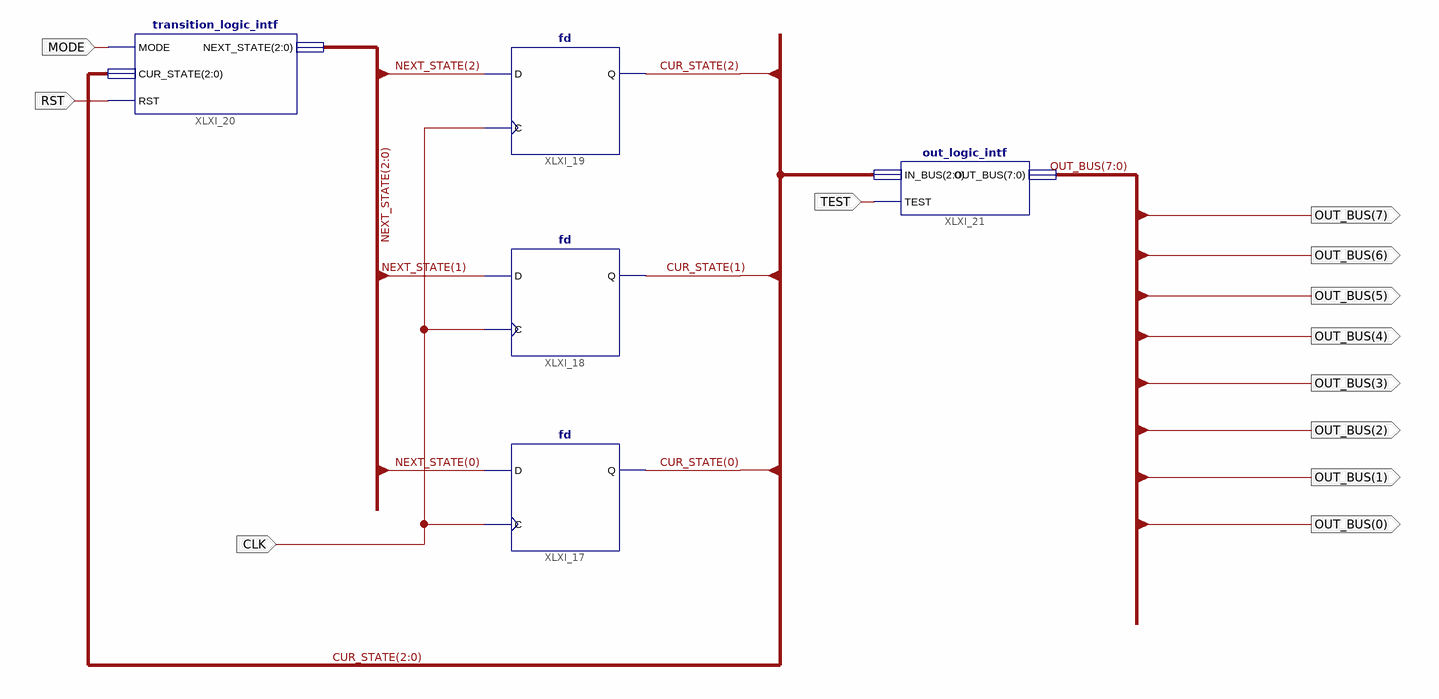
[diagram p0: schematic sheet 1]
// Xilinx ISE schematic LightController.sch (spartan3a) as structural Verilog: 5 symbols, 12 ports
module LightController (
  input  MODE,
  input  CLK,
  input  RST,
  input  TEST,
  output [7:0] OUT_BUS
);

  wire [2:0] CUR_STATE, NEXT_STATE;

  fd XLXI_17 (.C(CLK), .D(NEXT_STATE[0]), .Q(CUR_STATE[0]));
  fd XLXI_18 (.C(CLK), .D(NEXT_STATE[1]), .Q(CUR_STATE[1]));
  fd XLXI_19 (.C(CLK), .D(NEXT_STATE[2]), .Q(CUR_STATE[2]));
  transition_logic_intf XLXI_20 (.MODE(MODE), .CUR_STATE(CUR_STATE), .NEXT_STATE(NEXT_STATE), .RST(RST));
  out_logic_intf XLXI_21 (.TEST(TEST), .IN_BUS(CUR_STATE), .OUT_BUS(OUT_BUS));
endmodule
